# Altium project shahbazi5v.PrjPcb
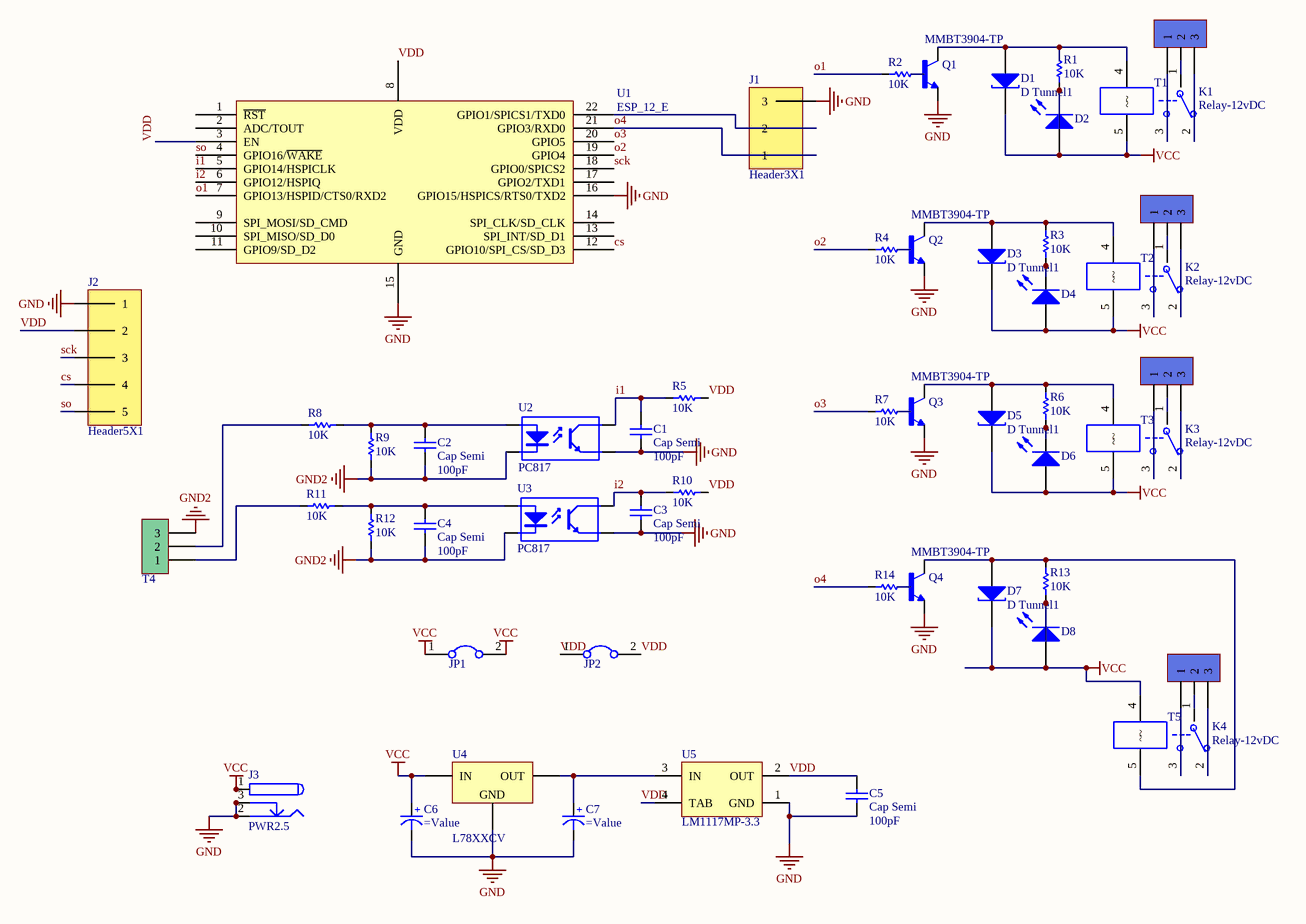
[diagram p0: sanati4i4o.SchDoc]
2 sheets, 150 parts. Net scope: global (net labels, ports and power ports of the same name join across sheets).
Board files: sanati4i4o.PcbDoc, shahbazi5v.PcbDoc
Sheets:
  sanati4i4o.SchDoc
  shahbazi5v.SchDoc

## Sheet sanati4i4o.SchDoc
size A3

### Parts
(Parts that share a designator on the sheet are numbered #1, #2 ... from top to bottom, then left to right.)
C1#1  Cap Semi  value 100pF  [C1206]
C2#1  Cap Semi  value 100pF  [C1206]
C3  Cap Semi  value 100pF  [C1206]
C4  Cap Semi  value 100pF  [C1206]
C5  Cap Semi  value 100pF  [C1206]
C6  (no value)  [ELEC-CAP-RAD10-20]
C7  (no value)  [ELEC-CAP-RAD10-20]
D1#1  D Tunnel1  [3.2X1.6X1.1]
D2#1  LED 3mm  [LED-3mm]  (value not drawn)
D3#1  D Tunnel1  [3.2X1.6X1.1]
D4#1  LED 3mm  [LED-3mm]  (value not drawn)
D5#1  D Tunnel1  [3.2X1.6X1.1]
D6#1  LED 3mm  [LED-3mm]  (value not drawn)
D7#1  D Tunnel1  [3.2X1.6X1.1]
D8#1  LED 3mm  [LED-3mm]  (value not drawn)
J1#1  Header3X1  [HEADER 3X1]
J2#1  Header5X1  [HEADER 5X1]
J3  PWR2.5  [KLD-0202]
JP1#1  Jumper  [Header 2X1]  (value not drawn)
JP2#1  Jumper  [Header 2X1]  (value not drawn)
K1#1  Relay-12vDC  [Relays]
K2#1  Relay-12vDC  [Relays]
K3#1  Relay-12vDC  [Relays]
K4#1  Relay-12vDC  [Relays]
Q1  MMBT3904-TP  [SOT23-3]
Q2  MMBT3904-TP  [SOT23-3]
Q3  MMBT3904-TP  [SOT23-3]
Q4  MMBT3904-TP  [SOT23-3]
R1#1  10K  [RES 1206 (3216X08L)]
R2#1  10K  [RES 1206 (3216X08L)]
R3#1  10K  [RES 1206 (3216X08L)]
R4#1  10K  [RES 1206 (3216X08L)]
R5#1  10K  [Res-(1/4)]
R6#1  10K  [RES 1206 (3216X08L)]
R7#1  10K  [RES 1206 (3216X08L)]
R8#1  10K  [RES 1206 (3216X08L)]
R9#1  10K  [RES 1206 (3216X08L)]
R10#1  10K  [Res-(1/4)]
R11#1  10K  [RES 1206 (3216X08L)]
R12#1  10K  [RES 1206 (3216X08L)]
R13#1  10K  [RES 1206 (3216X08L)]
R14#1  10K  [RES 1206 (3216X08L)]
T1#1  Terminal  [phoenix terminal R 3]  (value not drawn)
T2#1  Terminal  [phoenix terminal R 3]  (value not drawn)
T3#1  Terminal  [phoenix terminal R 3]  (value not drawn)
T4#1  Phoenix terminal  [phoenix terminal R 3]  (value not drawn)
T5#1  Terminal  [phoenix terminal R 3]  (value not drawn)
U1#1  ESP_12_E  [ESP_12_E]
U2#1  PC817  [DIP4]
U3#1  PC817  [DIP4]
U4#1  L78XXCV  [TO-220]
U5#1  LM1117MP-3.3  [MP04A_N]

### Nets
gND: C1#1.1 C3.1 C5.1 C6.1(-) C7.1(-) J1#1.3 J2#1.1 J3.2 J3.2A J3.2B J3.3 J3.3A J3.3B Q1.2(E) Q2.2(E) Q3.2(E) Q4.2(E) U1#1.15(GND) U1#1.16(GPIO15/HSPICS/RTS0/TXD2) U2#1.3(E) U3#1.3(E) U4#1.2(GND) U5#1.1(GND)
GND2: C2#1.1 C4.1 R9#1.1 R12#1.1 T4#1.3 U2#1.2(K) U3#1.2(K)
vcc: C6.2(+) D1#1.2(K) D2#1.1(A) D3#1.2(K) D4#1.1(A) D5#1.2(K) D6#1.1(A) D7#1.2(K) D8#1.1(A) J3.1 J3.1A J3.1B JP1#1.1 JP1#1.2 K1#1.5 K2#1.5 K3#1.5 K4#1.4 U4#1.1(IN)
VDD: C5.2 J2#1.2 JP2#1.1 JP2#1.2 R5#1.2 R10#1.2 U1#1.3(EN) U1#1.8(VDD) U5#1.2(OUT) U5#1.4(TAB)
cs: J2#1.4 U1#1.12(GPIO10/SPI_CS/SD_D3)
i1: C1#1.2 R5#1.1 U1#1.5(GPIO14/HSPICLK) U2#1.4(C)
i2: C3.2 R10#1.1 U1#1.6(GPIO12/HSPIQ) U3#1.4(C)
o1: R2#1.1 U1#1.7(GPIO13/HSPID/CTS0/RXD2)
o2: R4#1.1 U1#1.19(GPIO4)
o3: R7#1.1 U1#1.20(GPIO5)
o4: J1#1.1 R14#1.1 U1#1.21(GPIO3/RXD0)
sck: J2#1.3 U1#1.18(GPIO0/SPICS2)
so: J2#1.5 U1#1.4(GPIO16/~{WAKE})
NetC2#1_2: C2#1.2 R8#1.2 R9#1.2 U2#1.1(A)
NetC4_2: C4.2 R11#1.2 R12#1.2 U3#1.1(A)
NetC7_2: C7.2(+) U4#1.3(OUT) U5#1.3(IN)
NetD1#1_1: D1#1.1(A) K1#1.4 Q1.3(C) R1#1.2
NetD2#1_2: D2#1.2(K) R1#1.1
NetD3#1_1: D3#1.1(A) K2#1.4 Q2.3(C) R3#1.2
NetD4#1_2: D4#1.2(K) R3#1.1
NetD5#1_1: D5#1.1(A) K3#1.4 Q3.3(C) R6#1.2
NetD6#1_2: D6#1.2(K) R6#1.1
NetD7#1_1: D7#1.1(A) K4#1.5 Q4.3(C) R13#1.2
NetD8#1_2: D8#1.2(K) R13#1.1
NetJ1#1_2: J1#1.2 U1#1.22(GPIO1/SPICS1/TXD0)
NetK1#1_1: K1#1.1(COM) T1#1.2
NetK1#1_2: K1#1.2(NC) T1#1.3
NetK1#1_3: K1#1.3(NO) T1#1.1
NetK2#1_1: K2#1.1(COM) T2#1.2
NetK2#1_2: K2#1.2(NC) T2#1.3
NetK2#1_3: K2#1.3(NO) T2#1.1
NetK3#1_1: K3#1.1(COM) T3#1.2
NetK3#1_2: K3#1.2(NC) T3#1.3
NetK3#1_3: K3#1.3(NO) T3#1.1
NetK4#1_1: K4#1.1(COM) T5#1.2
NetK4#1_2: K4#1.2(NC) T5#1.3
NetK4#1_3: K4#1.3(NO) T5#1.1
NetQ1_1: Q1.1(B) R2#1.2
NetQ2_1: Q2.1(B) R4#1.2
NetQ3_1: Q3.1(B) R7#1.2
NetQ4_1: Q4.1(B) R14#1.2
NetR8#1_1: R8#1.1 T4#1.2
NetR11#1_1: R11#1.1 T4#1.1

Not connected (* = marked no-connect by the designer): U1#1 1(~{RST}) 2(ADC/TOUT) 9(SPI_MOSI/SD_CMD) 10(SPI_MISO/SD_D0) 11(GPIO9/SD_D2) 13(SPI_INT/SD_D1) 14(SPI_CLK/SD_CLK) 17(GPIO2/TXD1)

### Library data of the parts
C1#1 C2#1 C3-C5 = Cap Semi: Capacitor (Semiconductor SIM Model); Published: 8-Jun-2000; LatestRevisionDate: 29-May-2009; LatestRevisionNote: IPC-7351 Footprint Added.; PackageReference: C1206; Publisher: Altium Limited; PackageDescription: Chip Capacitor
C6 C7 = Capacitor Electrolytic: Electrolytic Capacitor
D1#1 D3#1 D5#1 D7#1 = D Tunnel1: Tunnel Diode - RLC Model; Published: 8-Jun-2000; LatestRevisionDate: 17-Jul-2002; LatestRevisionNote: Re-released for DXP Platform.; PackageVersion: Feb-2002; PackageReference: 3.2X1.6X1.1; Publisher: Altium Limited; PackageDescription: SM LED; 2 Flat Leads
D2#1 D4#1 D6#1 D8#1 = LED 3mm: Typical LED; Designer: Seyed Mohsen Ghasemian; Published: 02/04/2012; PackageReference: LED; Publisher: www.picpars.com; PackageDescription: LED; 2 Leads
J3 = PWR2.5: Low Voltage Power Supply Connector; Published: 17-Dec-2003; DatasheetDocument: 09-May-2002; Publisher: Altium Limited; ComponentLink1Description: Manufacturer Link; ComponentLink1URL: http://domino.kycon.com/internet/Products.html
K1#1 K2#1 K3#1 K4#1 = Relay-05vDC: Relay-05vDC-240AC 5A; Designer: Seyed Mohsen Ghasemain; ComponentLinkURL: www.picpars.com
Q1-Q4 = MMBT3904-TP: Bipolar _BJT_ Transistor NPN 40V 200mA 300MHz 350mW Surface Mount SOT-23; MF: Micro Commercial; Value: *; MP: MMBT3904-TP; Package: SOT-23 Micro Commercial; Price: None; Availability: Unavailable; SnapEDA_Link: https://www.snapeda.com/parts/MMBT3904-TP/Micro%20Commercial/view-part/805928/?ref=snap
R1#1 R2#1 R3#1 R4#1 R5#1 R6#1 R7#1 R8#1 R9#1 R10#1 R11#1 R12#1 R13#1 R14#1 = Resistor: Tolerance: 5%; Power: 1/4 W; Value: 10K
T1#1 T2#1 T3#1 T5#1 = Terminal 1*3: phoenix terminal R 3; Designer: Seyed Mohsen Ghasemain; E-mail: picpars@gmail.com; ComponentLinkURL: www.picpars.com
T4#1 = Phoenix terminal R 3: Right Terminal 3 Pin; Designer: Seyed Mohsen Ghasemain; E-mail: picpars@gmail.com; ComponentLinkURL: www.picpars.com
U1#1 = ESP_12_E: ESP-12 Wi-Fi Module by AI-Thinker; IC: ESP8266-EX; Vendor: Ai-thinker
U2#1 U3#1 = OPTCOUPLER_01: 4-Pin Phototransistor Optocoupler
U4#1 = L78XXCV: Fixed Voltage Regulator
U5#1 = LM1117MP-3.3: 800mA Low-Dropout Linear Regulator; Manufacturer: National Semiconductor; CompType: LDO IC; PackageTopMarking: XYTT*N05A; PowerWise: N; Published: 4-Dec-2008; DatasheetVersion: Apr-2006; PackageVersion: revB, Apr-2003; PackageReference: MP04A; Publisher: Altium Limited; PackageDescription: Molded SOT-223, 6.50 x 3.56 x 1.6mm Body, 4 Lead, 2.3mm Pitch; PartNumber: LM1117MP-3.3; RoHS: O; PinCount: 4; DigiKeyPartNumber: LM1117MP-3.3CT-ND; Code_JEDEC: TO-261-AA; Code_IPC: SOT223-4; ComponentLink1Description: LM1117 Datasheet; ComponentLink1URL: http://www.national.com/ds/LM/LM1117.pdf; ComponentLink2Description: LM1117 Web Page; ComponentLink2URL: http://www.national.com/pf/LM/LM1117.html; ComponentLink3Description: MP04A Package Page; ComponentLink3URL: http://www.national.com/packaging/folders/mp04a.html

## Sheet shahbazi5v.SchDoc
size A3
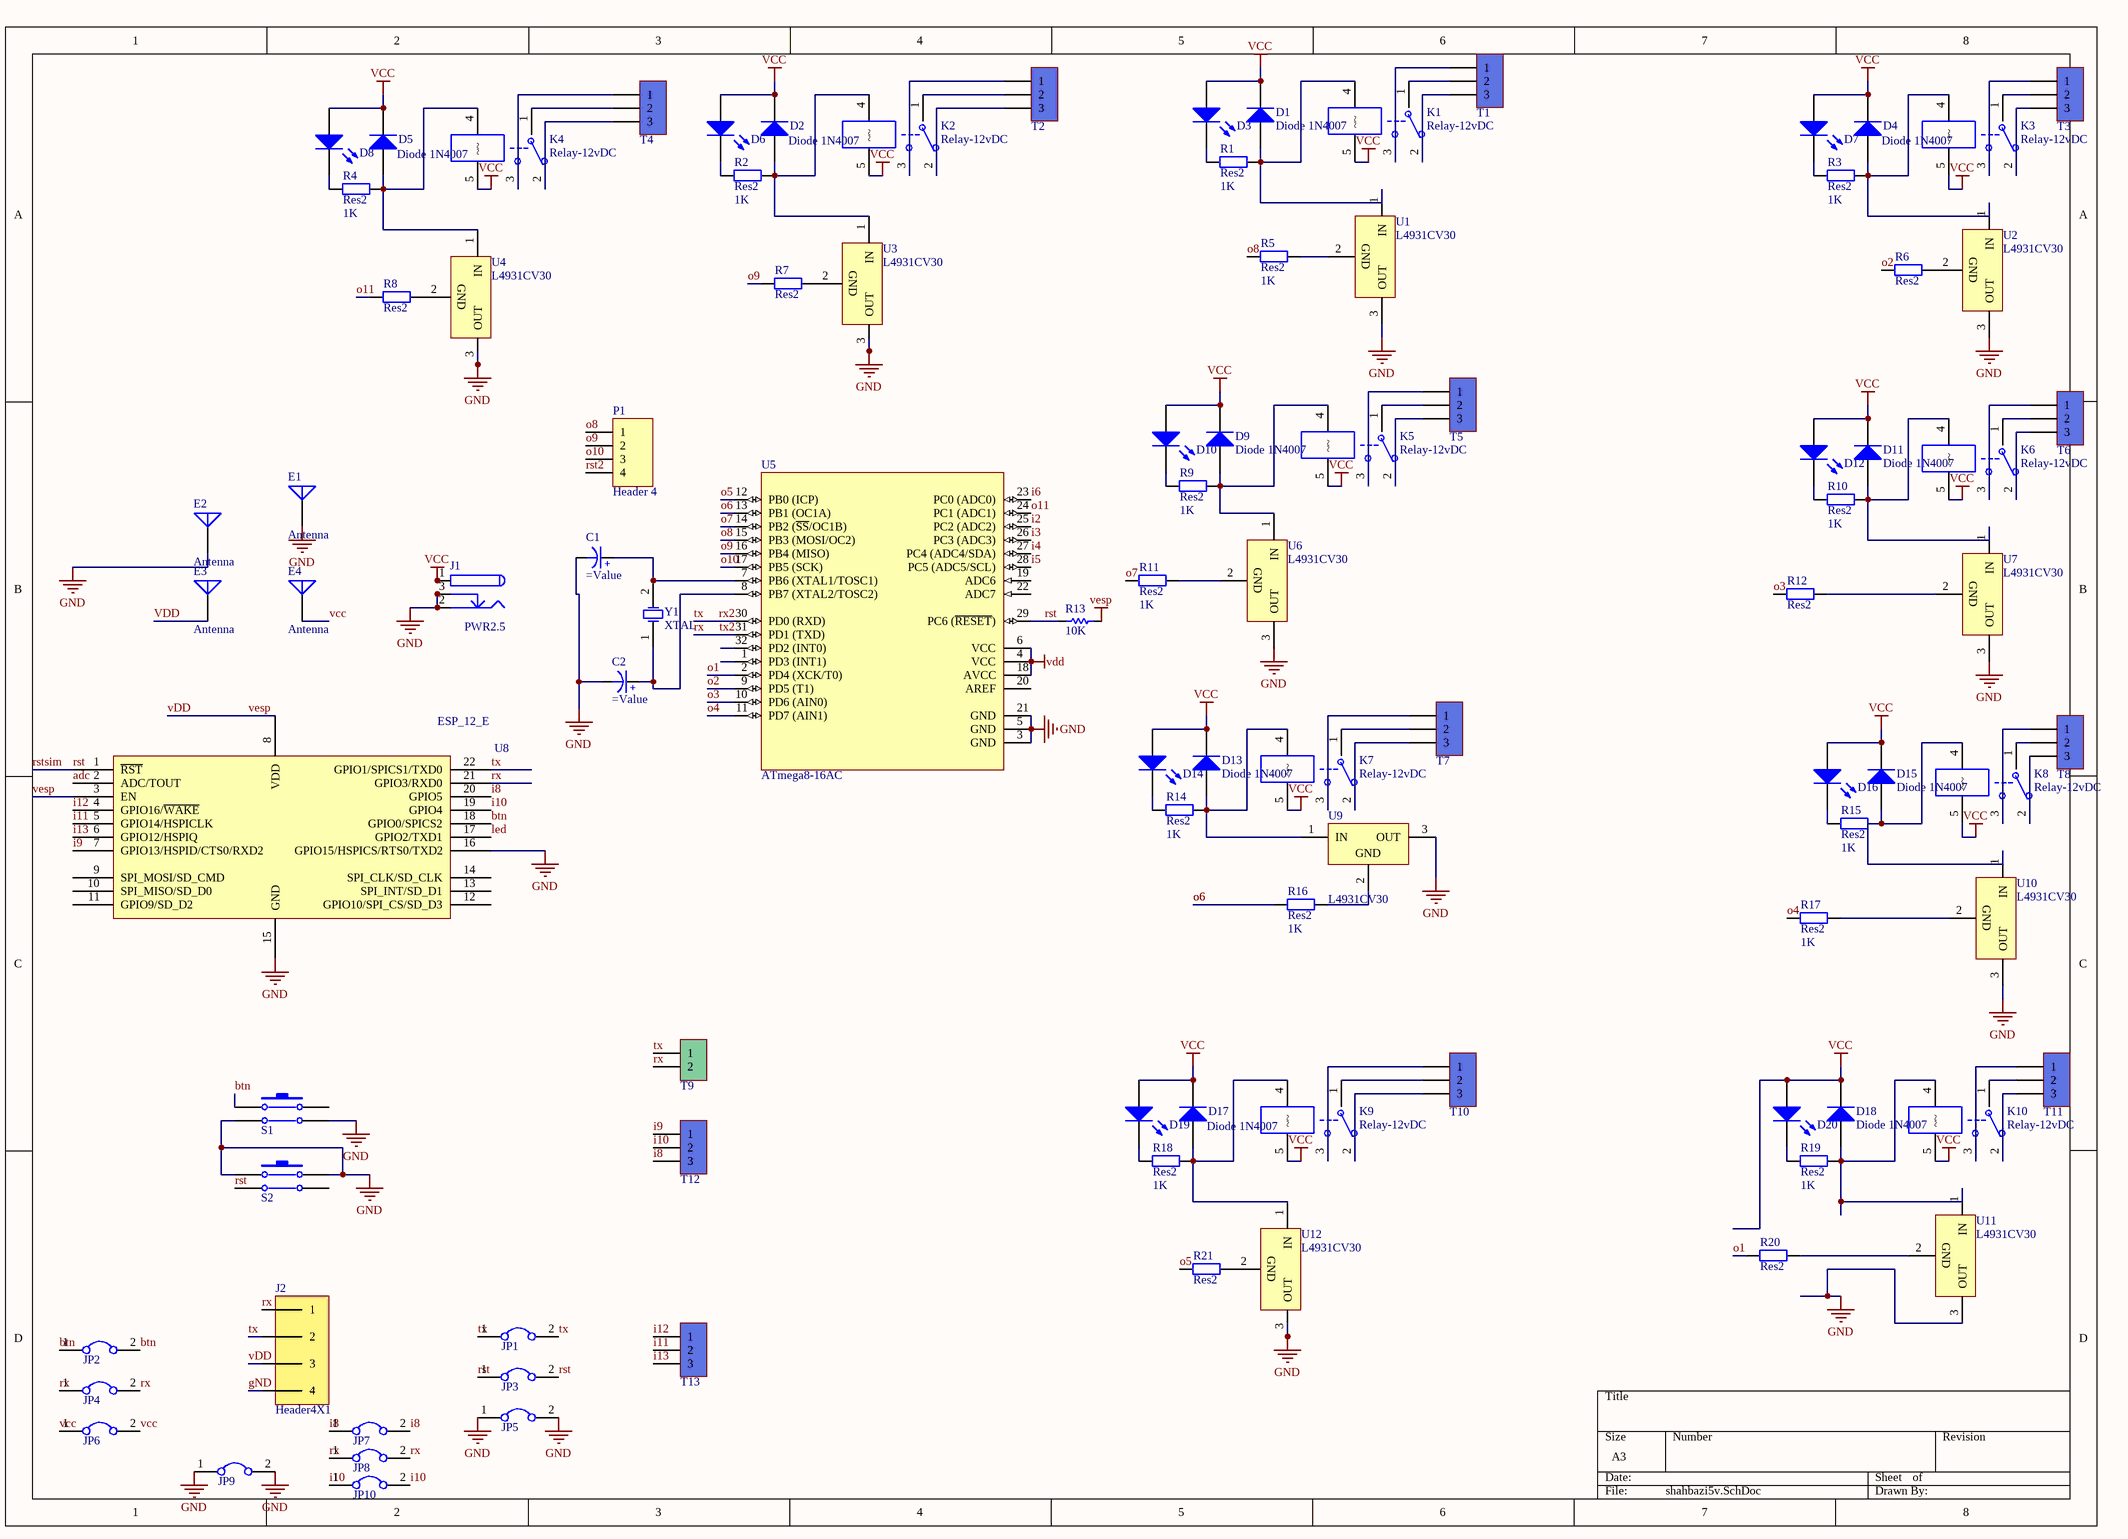
[diagram p1: shahbazi5v.SchDoc]

### Parts
(Parts that share a designator on the sheet are numbered #1, #2 ... from top to bottom, then left to right.)
C1#2  (no value)  [ELEC-CAP-RAD10-20]
C2#2  (no value)  [ELEC-CAP-RAD10-20]
D1#2  Diode 1N4007  [DO-41]
D2#2  Diode 1N4007  [DO-41]
D3#2  LED 3mm  [LED-3mm]  (value not drawn)
D4#2  Diode 1N4007  [DO-41]
D5#2  Diode 1N4007  [DO-41]
D6#2  LED 3mm  [LED-3mm]  (value not drawn)
D7#2  LED 3mm  [LED-3mm]  (value not drawn)
D8#2  LED 3mm  [LED-3mm]  (value not drawn)
D9  Diode 1N4007  [DO-41]
D10  LED 3mm  [LED-3mm]  (value not drawn)
D11  Diode 1N4007  [DO-41]
D12  LED 3mm  [LED-3mm]  (value not drawn)
D13  Diode 1N4007  [DO-41]
D14  LED 3mm  [LED-3mm]  (value not drawn)
D15  Diode 1N4007  [DO-41]
D16  LED 3mm  [LED-3mm]  (value not drawn)
D17  Diode 1N4007  [DO-41]
D18  Diode 1N4007  [DO-41]
D19  LED 3mm  [LED-3mm]  (value not drawn)
D20  LED 3mm  [LED-3mm]  (value not drawn)
E1  Antenna  [PIN1]
E2  Antenna  [PIN1]
E3  Antenna  [PIN1]
E4  Antenna  [PIN1]
J1#2  PWR2.5  [KLD-0202]
J2#2  Header4X1  [HEADER 4X1]
JP1#2  Jumper  [Header 2X1]  (value not drawn)
JP2#2  Jumper  [Header 2X1]  (value not drawn)
JP3  Jumper  [Header 2X1]  (value not drawn)
JP4  Jumper  [Header 2X1]  (value not drawn)
JP5  Jumper  [Header 2X1]  (value not drawn)
JP6  Jumper  [Header 2X1]  (value not drawn)
JP7  Jumper  [Header 2X1]  (value not drawn)
JP8  Jumper  [Header 2X1]  (value not drawn)
JP9  Jumper  [Header 2X1]  (value not drawn)
JP10  Jumper  [Header 2X1]  (value not drawn)
K1#2  Relay-12vDC  [Relays]
K2#2  Relay-12vDC  [Relays]
K3#2  Relay-12vDC  [Relays]
K4#2  Relay-12vDC  [Relays]
K5  Relay-12vDC  [Relays]
K6  Relay-12vDC  [Relays]
K7  Relay-12vDC  [Relays]
K8  Relay-12vDC  [Relays]
K9  Relay-12vDC  [Relays]
K10  Relay-12vDC  [Relays]
P1  Header 4  [HDR1X4]
R1#2  Res2  value 1K  [Res50]
R2#2  Res2  value 1K  [Res50]
R3#2  Res2  value 1K  [Res50]
R4#2  Res2  value 1K  [Res50]
R5#2  Res2  value 1K  [Res50]
R6#2  Res2  [Res50]
R7#2  Res2  [Res50]
R8#2  Res2  [Res50]
R9#2  Res2  value 1K  [Res50]
R10#2  Res2  value 1K  [Res50]
R11#2  Res2  value 1K  [Res50]
R12#2  Res2  [Res50]
R13#2  10K  [RES 1206 (3216X08L)]
R14#2  Res2  value 1K  [Res50]
R15  Res2  value 1K  [Res50]
R16  Res2  value 1K  [Res50]
R17  Res2  value 1K  [Res50]
R18  Res2  value 1K  [Res50]
R19  Res2  value 1K  [Res50]
R20  Res2  [Res50]
R21  Res2  [Res50]
S1  PUSH BUTTON DOUBLE  [PUSH BUTTON]  (value not drawn)
S2  PUSH BUTTON DOUBLE  [PUSH BUTTON]  (value not drawn)
T1#2  Terminal  [phoenix terminal R 3]  (value not drawn)
T2#2  Terminal  [phoenix terminal R 3]  (value not drawn)
T3#2  Terminal  [phoenix terminal R 3]  (value not drawn)
T4#2  Terminal  [phoenix terminal R 3]  (value not drawn)
T5#2  Terminal  [phoenix terminal R 3]  (value not drawn)
T6  Terminal  [phoenix terminal R 3]  (value not drawn)
T7  Terminal  [phoenix terminal R 3]  (value not drawn)
T8  Terminal  [phoenix terminal R 3]  (value not drawn)
T9  Phoenix terminal  [phoenix terminal R 2]  (value not drawn)
T10  Terminal  [phoenix terminal R 3]  (value not drawn)
T11  Terminal  [phoenix terminal R 3]  (value not drawn)
T12  Terminal  [phoenix terminal R 3]  (value not drawn)
T13  Terminal  [phoenix terminal R 3]  (value not drawn)
U1#2  L4931CV30  [TO-220A]
U2#2  L4931CV30  [TO-220A]
U3#2  L4931CV30  [TO-220A]
U4#2  L4931CV30  [TO-220A]
U5#2  ATmega8-16AC  [32A_N]
U6  L4931CV30  [TO-220A]
U7  L4931CV30  [TO-220A]
U8  ESP_12_E  [ESP_12_E]
U9  L4931CV30  [TO-220A]
U10  L4931CV30  [TO-220A]
U11  L4931CV30  [TO-220A]
U12  L4931CV30  [TO-220A]
Y1  XTAL  [R38]

### Nets
gND: C1#2.1(-) C2#2.1(-) E1.1(A) E2.1(A) J1#2.2 J1#2.2A J1#2.2B J1#2.3 J1#2.3A J1#2.3B J2#2.4 JP5.1 JP5.2 JP9.1 JP9.2 S1.3 S1.4 S2.1 S2.2 U1#2.3(OUT) U2#2.3(OUT) U3#2.3(OUT) U4#2.3(OUT) U5#2.3(GND) U5#2.5(GND) U5#2.21(GND) U6.3(OUT) U7.3(OUT) U8.15(GND) U8.16(GPIO15/HSPICS/RTS0/TXD2) U9.3(OUT) U10.3(OUT) U11.3(OUT) U12.3(OUT)
vcc: D1#2.2(K) D2#2.2(K) D3#2.1(A) D4#2.2(K) D5#2.2(K) D6#2.1(A) D7#2.1(A) D8#2.1(A) D9.2(K) D10.1(A) D11.2(K) D12.1(A) D13.2(K) D14.1(A) D15.2(K) D16.1(A) D17.2(K) D18.2(K) D19.1(A) D20.1(A) E4.1(A) J1#2.1 J1#2.1A J1#2.1B JP6.1 JP6.2 K1#2.5 K2#2.5 K3#2.5 K4#2.5 K5.5 K6.5 K7.5 K8.5 K9.5 K10.5
VDD: E3.1(A) J2#2.3 R13#2.2 U5#2.4(VCC) U5#2.6(VCC) U5#2.18(AVCC) U8.3(EN) U8.8(VDD)  [also labelled vesp]
adc: U8.2(ADC/TOUT)
btn: JP2#2.1 JP2#2.2 S1.1 U8.18(GPIO0/SPICS2)
i2: U5#2.25(PC2_(ADC2))
i3: U5#2.26(PC3_(ADC3))
i4: U5#2.27(PC4_(ADC4/SDA))
i5: U5#2.28(PC5_(ADC5/SCL))
i6: U5#2.23(PC0_(ADC0))
i8: JP7.1 JP7.2 T12.3 U8.20(GPIO5)
i9: T12.1 U8.7(GPIO13/HSPID/CTS0/RXD2)
i10: JP10.1 JP10.2 T12.2 U8.19(GPIO4)
i11: T13.2 U8.5(GPIO14/HSPICLK)
i12: T13.1 U8.4(GPIO16/~{WAKE})
i13: T13.3 U8.6(GPIO12/HSPIQ)
led: U8.17(GPIO2/TXD1)
o1: R20.1 U5#2.2(PD4_(XCK/T0))
o2: R6#2.1 U5#2.9(PD5_(T1))
o3: R12#2.1 U5#2.10(PD6_(AIN0))
o4: R17.1 U5#2.11(PD7_(AIN1))
o5: R21.1 U5#2.12(PB0_(ICP))
o6: R16.1 U5#2.13(PB1_(OC1A))
o7: R11#2.1 U5#2.14(PB2_(~{SS}/OC1B))
o8: P1.1 R5#2.1 U5#2.15(PB3_(MOSI/OC2))
o9: P1.2 R7#2.1 U5#2.16(PB4_(MISO))
o10: P1.3 U5#2.17(PB5_(SCK))
o11: R8#2.1 U5#2.24(PC1_(ADC1))
rst: JP3.1 JP3.2 R13#2.1 S2.3 U5#2.29(PC6_(~{RESET})) U8.1(~{RST})  [also labelled rstsim]
rst2: P1.4
rx: J2#2.1 JP4.1 JP4.2 JP8.1 JP8.2 T9.2 U5#2.31(PD1_(TXD)) U8.21(GPIO3/RXD0)  [also labelled tx2]
rx2: J2#2.2 JP1#2.1 JP1#2.2 T9.1 U5#2.30(PD0_(RXD)) U8.22(GPIO1/SPICS1/TXD0)  [also labelled tx]
NetC1#2_2: C1#2.2(+) U5#2.7(PB6_(XTAL1/TOSC1)) Y1.2(OSC2)
NetC2#2_2: C2#2.2(+) U5#2.8(PB7_(XTAL2/TOSC2)) Y1.1(OSC1)
NetD1#2_1: D1#2.1(A) K1#2.4 R1#2.2 U1#2.1(IN)
NetD2#2_1: D2#2.1(A) K2#2.4 R2#2.2 U3#2.1(IN)
NetD3#2_2: D3#2.2(K) R1#2.1
NetD4#2_1: D4#2.1(A) K3#2.4 R3#2.2 U2#2.1(IN)
NetD5#2_1: D5#2.1(A) K4#2.4 R4#2.2 U4#2.1(IN)
NetD6#2_2: D6#2.2(K) R2#2.1
NetD7#2_2: D7#2.2(K) R3#2.1
NetD8#2_2: D8#2.2(K) R4#2.1
NetD9_1: D9.1(A) K5.4 R9#2.2 U6.1(IN)
NetD10_2: D10.2(K) R9#2.1
NetD11_1: D11.1(A) K6.4 R10#2.2 U7.1(IN)
NetD12_2: D12.2(K) R10#2.1
NetD13_1: D13.1(A) K7.4 R14#2.2 U9.1(IN)
NetD14_2: D14.2(K) R14#2.1
NetD15_1: D15.1(A) K8.4 R15.2 U10.1(IN)
NetD16_2: D16.2(K) R15.1
NetD17_1: D17.1(A) K9.4 R18.2 U12.1(IN)
NetD18_1: D18.1(A) K10.4 R19.2 U11.1(IN)
NetD19_2: D19.2(K) R18.1
NetD20_2: D20.2(K) R19.1
NetK1#2_1: K1#2.1(COM) T1#2.2
NetK1#2_2: K1#2.2(NC) T1#2.3
NetK1#2_3: K1#2.3(NO) T1#2.1
NetK2#2_1: K2#2.1(COM) T2#2.2
NetK2#2_2: K2#2.2(NC) T2#2.3
NetK2#2_3: K2#2.3(NO) T2#2.1
NetK3#2_1: K3#2.1(COM) T3#2.2
NetK3#2_2: K3#2.2(NC) T3#2.3
NetK3#2_3: K3#2.3(NO) T3#2.1
NetK4#2_1: K4#2.1(COM) T4#2.2
NetK4#2_2: K4#2.2(NC) T4#2.3
NetK4#2_3: K4#2.3(NO) T4#2.1
NetK5_1: K5.1(COM) T5#2.2
NetK5_2: K5.2(NC) T5#2.3
NetK5_3: K5.3(NO) T5#2.1
NetK6_1: K6.1(COM) T6.2
NetK6_2: K6.2(NC) T6.3
NetK6_3: K6.3(NO) T6.1
NetK7_1: K7.1(COM) T7.2
NetK7_2: K7.2(NC) T7.3
NetK7_3: K7.3(NO) T7.1
NetK8_1: K8.1(COM) T8.2
NetK8_2: K8.2(NC) T8.3
NetK8_3: K8.3(NO) T8.1
NetK9_1: K9.1(COM) T10.2
NetK9_2: K9.2(NC) T10.3
NetK9_3: K9.3(NO) T10.1
NetK10_1: K10.1(COM) T11.2
NetK10_2: K10.2(NC) T11.3
NetK10_3: K10.3(NO) T11.1
NetR5#2_2: R5#2.2 U1#2.2(GND)
NetR6#2_2: R6#2.2 U2#2.2(GND)
NetR7#2_2: R7#2.2 U3#2.2(GND)
NetR8#2_2: R8#2.2 U4#2.2(GND)
NetR11#2_2: R11#2.2 U6.2(GND)
NetR12#2_2: R12#2.2 U7.2(GND)
NetR16_2: R16.2 U9.2(GND)
NetR17_2: R17.2 U10.2(GND)
NetR20_2: R20.2 U11.2(GND)
NetR21_2: R21.2 U12.2(GND)

Not connected (* = marked no-connect by the designer): S1 2; S2 4; U5#2 1(PD3_(INT1)) 19(ADC6) 20(AREF) 22(ADC7) 32(PD2_(INT0)); U8 9(SPI_MOSI/SD_CMD) 10(SPI_MISO/SD_D0) 11(GPIO9/SD_D2) 12(GPIO10/SPI_CS/SD_D3) 13(SPI_INT/SD_D1) 14(SPI_CLK/SD_CLK)

### Library data of the parts
C1#2 C2#2 = Capacitor Electrolytic: Electrolytic Capacitor
D1#2 D2#2 D4#2 D5#2 D9 D11 D13 D15 D17 D18 = Diode 1N4007: 1 Amp General Purpose Rectifier; Published: 8-Jun-2000; LatestRevisionDate: 17-Jul-2002; LatestRevisionNote: Re-released for DXP Platform.; DatasheetVersion: 1998; PackageVersion: Aug-1999; PackageReference: DO-41; Publisher: Altium Limited; PackageDescription: Diode, Axial; Body 5.2 x 2.7 mm (LxDia. max), Lead Dia. 0.86 mm (max); Code_JEDEC: DO-204-AL; ComponentLink1Description: Manufacturer Link; ComponentLink1URL: http://www.fairchildsemi.com/; ComponentLink2Description: Datasheet; ComponentLink2URL: http://www.fairchildsemi.com/ds/1N%2F1N4001.pdf
D3#2 D6#2 D7#2 D8#2 D10 D12 D14 D16 D19 D20 = LED 3mm: as D2#1 on sheet sanati4i4o; Published: 02/04/2012; PackageReference: LED; Publisher: www.picpars.com; PackageDescription: LED; 2 Leads
E1-E4 = Antenna: Generic Antenna; Published: 24-Mar-1999; LatestRevisionDate: 17-Jul-2002; LatestRevisionNote: Re-released for DXP Platform.; PackageReference: PIN1; Publisher: Altium Limited
J1#2 = PWR2.5: Low Voltage Power Supply Connector; Published: 17-Dec-2003; DatasheetDocument: 09-May-2002; Publisher: Altium Limited; ComponentLink1Description: Manufacturer Link; ComponentLink1URL: http://domino.kycon.com/internet/Products.html
K1#2 K2#2 K3#2 K4#2 K5-K10 = Relay-05vDC: as K1#1 on sheet sanati4i4o; ComponentLinkURL: www.picpars.com
P1 = Header 4: Header, 4-Pin; LatestRevisionDate: 17-Jul-2002; LatestRevisionNote: Re-released for DXP Platform.; Publisher: Altium Limited
R1#2 R2#2 R3#2 R4#2 R5#2 R6#2 R7#2 R8#2 R9#2 R10#2 R11#2 R12#2 R14#2 R15-R21 = Res2: Resistor; Published: 8-Jun-2000; LatestRevisionDate: 17-Jul-2002; LatestRevisionNote: Re-released for DXP Platform.; Publisher: Altium Limited; PackageDescription: Axial Device, Thru-Hole; 2 Leads; 0.4 in Pin Spacing
  R1#2 R2#2 R3#2 R4#2 R5#2 R6#2 R7#2 R8#2 R9#2 R10#2 R11#2 R12#2 R15-R21: PackageReference: AXIAL-0.4
  R14#2: PackageReference: Res50
R13#2 = Resistor: Tolerance: 5%; Power: 1/4 W; Value: 10K
S1 S2 = PUSH BUTTON DOUBLE: Switch
T1#2 T2#2 T3#2 T4#2 T5#2 T6-T8 T10 T11 = Terminal 1*3: as T1#1 on sheet sanati4i4o; ComponentLinkURL: www.picpars.com
T9 = Phoenix terminal R 2: Right Terminal 2 Pin; Designer: Seyed Mohsen Ghasemain; E-mail: picpars@gmail.com; ComponentLinkURL: www.picpars.com
T12 T13 = Terminal 1*3: Terminal 3 Pin 250VAC 16A; Designer: Seyed Mohsen Ghasemain; E-mail: picpars@gmail.com; ComponentLinkURL: www.picpars.com
U1#2 U2#2 U3#2 U4#2 U6 U7 U9-U12 = L4931CV30: 250mA, Very Low Drop ( 0.4V) Voltage Regulator; Published: 24-Aug-2001; LatestRevisionDate: 06-Jun-2005; LatestRevisionNote: PCB Pin sequence re-ordered.; DatasheetVersion: Apr-1999; PackageVersion: Jul-2004; PackageReference: TO-220A; Publisher: Altium Limited; PackageDescription: TO, Thru-Hole, Vertical, Heatsink Mounted; 3 In-Line Leads; Pitch 2.54 mm; ComponentLink1Description: Manufacturer Link; ComponentLink1URL: http://www.st.com/; ComponentLink2Description: Datasheet; ComponentLink2URL: http://www.st.com/stonline/products/literature/ds/4340/l4931abxx15.pdf
U5#2 = ATmega8-16AC: 8-Bit AVR Microcontroller with 8K Bytes of In-System Programmable Flash Memory; Published: 17-Sep-2003; LatestRevisionDate: 16-Oct-2006; LatestRevisionNote: IPC-7351 Footprint Added.; DatasheetVersion: 2486H-AVR-09/02; PackageVersion: revB, Oct-2001; PackageReference: 32A; Publisher: Altium Limited; PackageDescription: 32-Lead, 7x7x1.0 mm Body, 0.8mm Lead Pitch, Thin Profile Plastic Quad Flat Package (TQFP); Supplier 1: Digi-Key; Supplier Part Number 1: ATMEGA8-16AC-ND; Supplier 2: Mouser; Supplier Part Number 2: 556-ATMEGA8-16AC; Code_JEDEC: MS-026-ABA; ComponentLink1Description: Datasheet; ComponentLink1URL: http://www.atmel.com/dyn/resources/prod_documents/doc2486.pdf; ComponentLink2Description: Atmel.com Home; ComponentLink2URL: http://www.atmel.com
U8 = ESP_12_E: as U1#1 on sheet sanati4i4o; Vendor: Ai-thinker
Y1 = XTAL: Crystal Oscillator; Published: 8-Jun-2000; LatestRevisionDate: 17-Jul-2002; LatestRevisionNote: Re-released for DXP Platform.; PackageReference: R38; Publisher: Altium Limited; PackageDescription: Crystal, Thru-Hole; 2 Leads; Body 3.1 x 8.2 mm (Dia.xH)

## Nets that join several sheets
gND: sanati4i4o (23 pins), shahbazi5v (34 pins)
vcc: sanati4i4o (19 pins), shahbazi5v (36 pins)
VDD: sanati4i4o (10 pins), shahbazi5v (8 pins)
i2: sanati4i4o (C3.2 R10#1.1 U1#1.6 U3#1.4), shahbazi5v (U5#2.25)
o1: sanati4i4o (R2#1.1 U1#1.7), shahbazi5v (R20.1 U5#2.2)
o2: sanati4i4o (R4#1.1 U1#1.19), shahbazi5v (R6#2.1 U5#2.9)
o3: sanati4i4o (R7#1.1 U1#1.20), shahbazi5v (R12#2.1 U5#2.10)
o4: sanati4i4o (J1#1.1 R14#1.1 U1#1.21), shahbazi5v (R17.1 U5#2.11)